# Altium schematic sheet Controller_PCB_Base.SchDoc
size A4
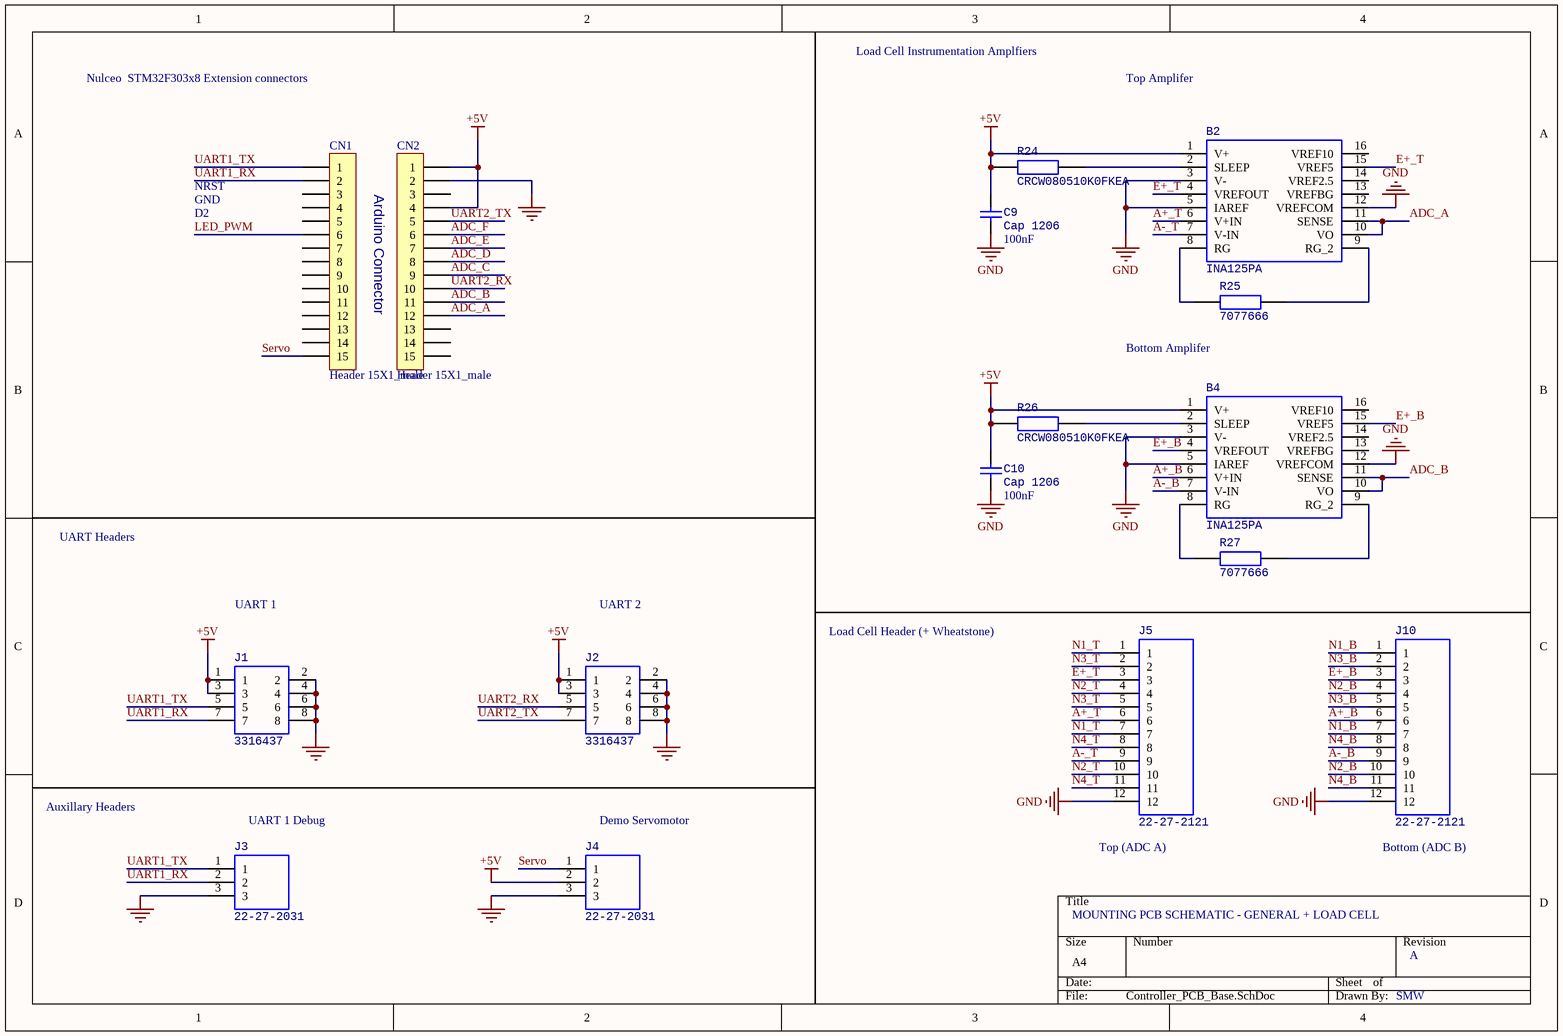
[diagram p0: Controller_PCB_Base.SchDoc]

## Parts
B2  INA125PA  [DIP254P762X508-16]
B4  INA125PA  [DIP254P762X508-16]
C9  Cap 1206  value 100nF  [C1206]
C10  Cap 1206  value 100nF  [C1206]
CN1  Header 15X1_male  [HDR_1x15_2R54_V_F]
CN2  Header 15X1_male  [HDR_1x15_2R54_V_F]
J1  3316437  [RJ45-8]
J2  3316437  [RJ45-8]
J3  22-27-2031  [SHDR3W64P0X254_1X3_762X580X1170P]
J4  22-27-2031  [SHDR3W64P0X254_1X3_762X580X1170P]
J5  22-27-2121  [HDRV12W64P0X254_1X12_3048X580X1170P]
J10  22-27-2121  [HDRV12W64P0X254_1X12_3048X580X1170P]
R24  CRCW080510K0FKEA  [RESC2012X50N]
R25  7077666  [RESAD1550W58L630D230]
R26  CRCW080510K0FKEA  [RESC2012X50N]
R27  7077666  [RESAD1550W58L630D230]

## Nets
+5V: B2.1(V+) B4.1(V+) C9.2 C10.2 CN2.1 CN2.4 J1.1 J1.3 J2.1 J2.3 J4.2 R24.1 R26.1
GND: B2.3(V-) B2.5(IAREF) B2.12(VREFCOM) B4.3(V-) B4.5(IAREF) B4.12(VREFCOM) C9.1 C10.1 CN2.2 J1.2 J1.4 J1.6 J1.8 J2.2 J2.4 J2.6 J2.8 J3.3 J4.3 J5.12 J10.12
A+_B: B4.6(V+IN) J10.6
A+_T: B2.6(V+IN) J5.6
A-_B: B4.7(V-IN) J10.9
A-_T: B2.7(V-IN) J5.9
ADC_A: B2.10(VO) B2.11(SENSE) CN2.12
ADC_B: B4.10(VO) B4.11(SENSE) CN2.11
ADC_C: CN2.9
ADC_D: CN2.8
ADC_E: CN2.7
ADC_F: CN2.6
E+_B: B4.4(VREFOUT) B4.15(VREF5) J10.3
E+_T: B2.4(VREFOUT) B2.15(VREF5) J5.3
LED_PWM: CN1.6
N1_B: J10.1 J10.7
N1_T: J5.1 J5.7
N2_B: J10.4 J10.10
N2_T: J5.4 J5.10
N3_B: J10.2 J10.5
N3_T: J5.2 J5.5
N4_B: J10.8 J10.11
N4_T: J5.8 J5.11
Servo: CN1.15 J4.1
UART1_RX: CN1.2 J1.7 J3.2
UART1_TX: CN1.1 J1.5 J3.1
UART2_RX: CN2.10 J2.5
UART2_TX: CN2.5 J2.7
NetB2_2: B2.2(SLEEP) R24.2
NetB2_8: B2.8(RG) R25.1
NetB2_9: B2.9(RG_2) R25.2
NetB4_2: B4.2(SLEEP) R26.2
NetB4_8: B4.8(RG) R27.1
NetB4_9: B4.9(RG_2) R27.2

Not connected (* = marked no-connect by the designer): B2 13(VREFBG) 14(VREF2.5) 16(VREF10); B4 13(VREFBG) 14(VREF2.5) 16(VREF10); CN1 3 4 5 7 8 9 10 11 12 13 14; CN2 3 13 14 15

## Notes on the sheet
- Nulceo  STM32F303x8 Extension connectors
- Load Cell Instrumentation Amplfiers
- Top Amplifer
- NRST
- GND
- D2
- Arduino Connector
- Bottom Amplifer
- UART Headers
- UART 1
- UART 2
- Load Cell Header (+ Wheatstone)
- Auxillary Headers
- (near J3) UART 1 Debug
- (near J4) Demo Servomotor
- (near J5) Top (ADC A)
- (near J10) Bottom (ADC B)
- MOUNTING PCB SCHEMATIC - GENERAL + LOAD CELL
- A
- SMW

## Library data of the parts
B2 B4 = INA125PA: Instrumentation Amplifier with Precision Voltage Reference; Manufacturer_Name: Texas Instruments; RS Part Number: 2521593P; Manufacturer_Part_Number: INA125PA; Datasheet Link: http://uk.rs-online.com/web/p/products/2521593P
C9 C10 = Cap Semi: Capacitor (Semiconductor SIM Model); Published: 8-Jun-2000; LatestRevisionDate: 29-May-2009; LatestRevisionNote: IPC-7351 Footprint Added.; PackageReference: C1206; Publisher: Altium Limited; PackageDescription: Chip Capacitor
CN1 CN2 = Header 15X1_Female_1: Header, 10-Pin, Single row,female; LatestRevisionDate: 17-Jul-2002; LatestRevisionNote: Re-released for DXP Platform.; Publisher: Altium Limited
J1 J2 = 3316437: 8/8 way r/a PCB lowprofile data skt,1.5A RS Pro Female Cat5 RJ45 Connector, Unshielded, Right Angle, PCB Mount Mount,; Manufacturer_Name: RS Components; Allied_Number: 70643325; RS Part Number: 3316437; Manufacturer_Part_Number: 3316437; Datasheet Link: http://uk.rs-online.com/web/p/products/3316437
J3 J4 = 22-27-2031: 3way straight PCB header w/friction lock Molex KK Series, Series Number 6410, 2.54mm Pitch 3 Way 1 Row Straight PCB Header, Solder Termination, 4A; Allied_Number: 70190935; Geometry.Height: 11.7mm; RS Part Number: 1707102; Manufacturer_Name: Molex; Manufacturer_Part_Number: 22-27-2031; Datasheet Link: http://uk.rs-online.com/web/p/products/1707102
J5 J10 = 22-27-2121: 12way straightPCB header w/friction lock Molex KK Series, Series Number 6410, 2.54mm Pitch 12 Way 1 Row Straight PCB Header, Solder Termination, 4A; Allied_Number: 70373056; Geometry.Height: 11.7mm; RS Part Number: 1707108; Manufacturer_Name: Molex; Manufacturer_Part_Number: 22-27-2121; Datasheet Link: http://uk.rs-online.com/web/p/products/1707108
R24 R26 = CRCW080510K0FKEA: CRCW0805 Resistor T/R 0.125W,1%,10K Vishay CRCW Series Thick Film Surface Mount Resistor 0805 Case 10k 1% 0.125W 100ppm/C; Allied_Number: 70203987; Geometry.Height: 0.5mm; RS Part Number: 1694499; Manufacturer_Name: Vishay; Manufacturer_Part_Number: CRCW080510K0FKEA; Datasheet Link: http://uk.rs-online.com/web/p/products/1694499
R25 R27 = 7077666: RS Pro RS Series Axial Carbon Resistor 1k 5% 0.25W -500  +350ppm/C; Manufacturer_Name: RS Components; RS Part Number: 7077666; Manufacturer_Part_Number: 7077666; Datasheet Link: https://componentsearchengine.com/Datasheets/3/7077666.pdf